# EasyEDA Pro project EasyEDA_Pro_SMD_3128_BM_3.epro, schematic CPLD Cartridge Schematic
Board Name: CPLD Cartridge; Create Date: 2026-02-11; Page Name: P1; Project Name: Flash Genesis/MD/32X Reproduction Cartridge; Schematic Name: CPLD Cartridge Schematic; Update Date: 2026-02-21; Company: EasyEDA.com; Drawed: Stargazer; Page Size: A3; Part Number: SMD_3128_BM_3; Reviewed: EasyEDA Pro; Version: R0
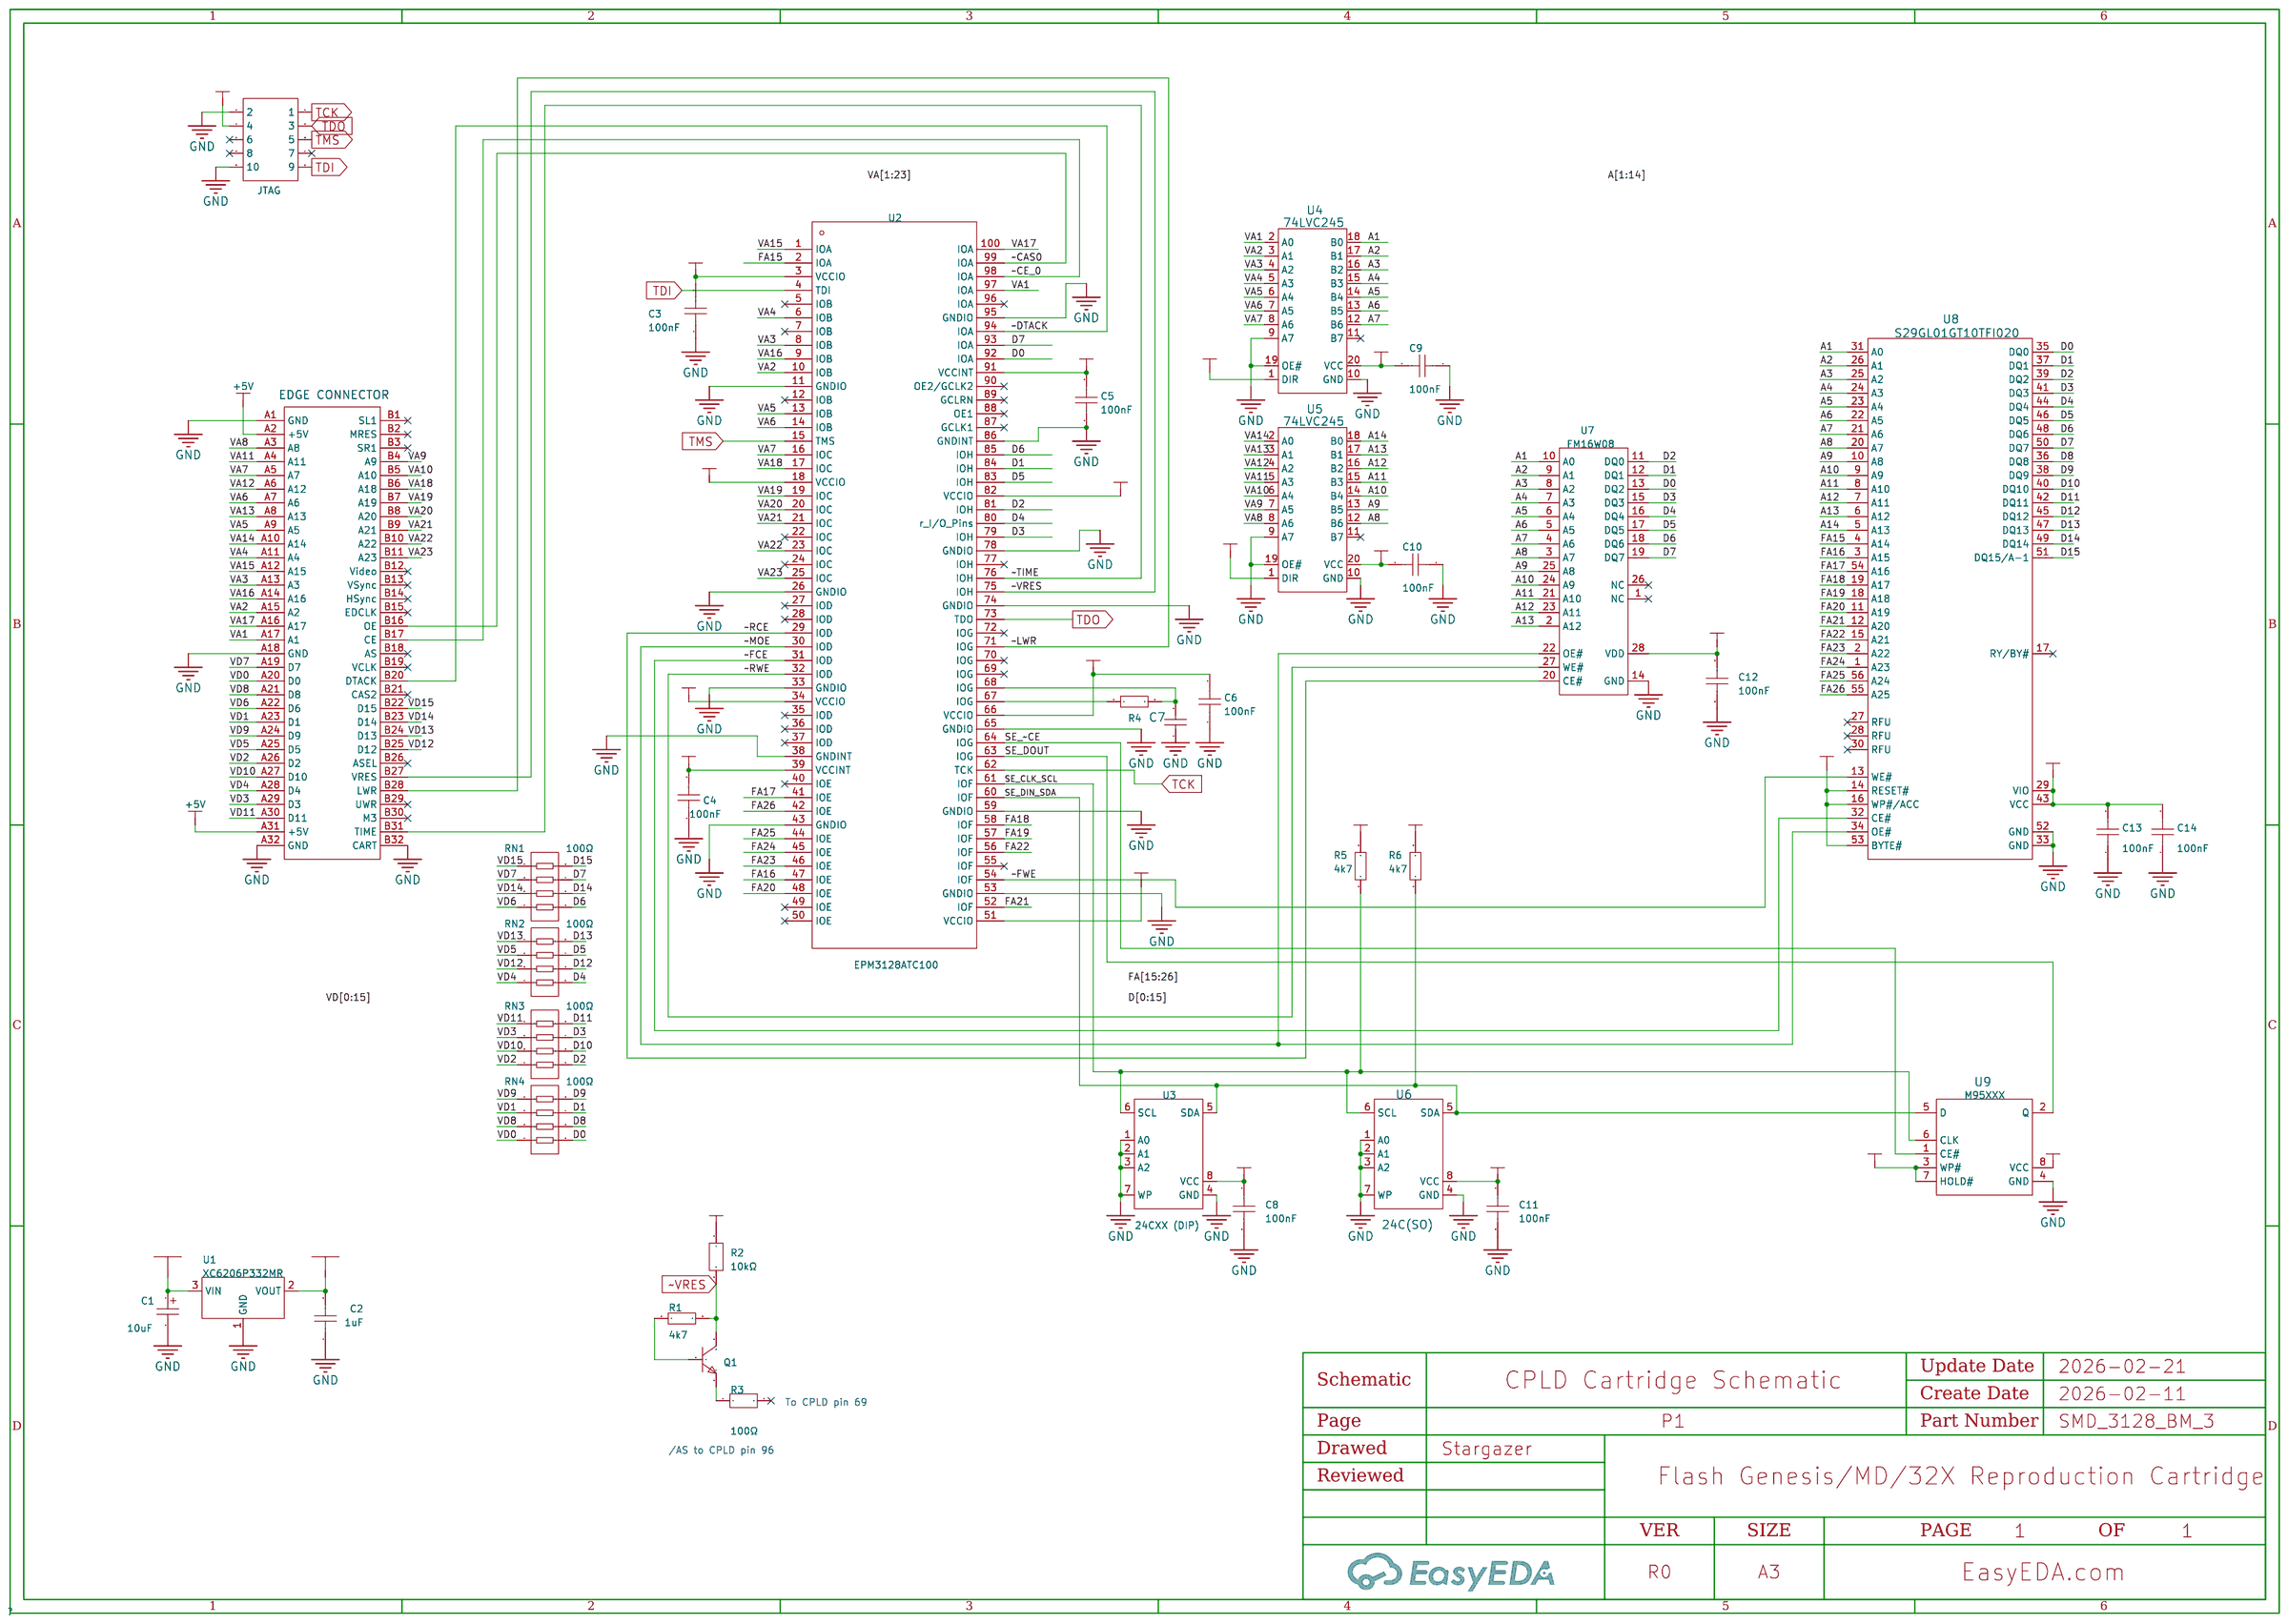
[diagram p0: schematic sheet]

## Parts
C1  10uF  [CASE-A_3216]
C2  1uF  [C0805]
C3  100nF  [C0603]
C4  100nF  [C0603]
C5  100nF  [C0603]
C6  100nF  [C0603]
C7  220pF  [C0402]
C8  100nF  [C0603]
C9  100nF  [C0603]
C10  100nF  [C0603]
C11  100nF  [C0603]
C12  100nF  [C0603]
C13  100nF  [C0603]
C14  100nF  [C0603]
CN1  JTAG  [IDC-TH_10P-P2.54_C5665]
CON1  EDGE CONNECTOR  [SEGA GENESIS CARTRIDGE EDGE CONNETOR]  (no BOM)
Q1  S8050 J3Y(RANGE:200-350)  [SOT-23-3_L3.0-W1.7-P0.95-LS2.9-BR]  (no BOM)
R1  4.7kΩ  [R0603]  (no BOM)
R2  10kΩ  [R0603]  (no BOM)
R3  100Ω  [R0603]  (no BOM)
R4  330Ω  [R0402]
R5  4.7kΩ  [R0603]
R6  4.7kΩ  [R0603]
RN1  100Ω  [RES-ARRAY-SMD_0603-8P-L3.2-W1.6-BL]
RN2  100Ω  [RES-ARRAY-SMD_0603-8P-L3.2-W1.6-BL]
RN3  100Ω  [RES-ARRAY-SMD_0603-8P-L3.2-W1.6-BL]
RN4  100Ω  [RES-ARRAY-SMD_0603-8P-L3.2-W1.6-BL]
U1  XC6206P332MR  [SOT-23-3_L2.9-W1.6-P1.90-LS2.8-BR]
U2  EPM3128ATC100  [TQFP-100_L14.0-W14.0-P0.50-LS16.0-BL]
U3  24CXX (DIP)  [PDIP-8_L9.6-W6.4-P2.54-LS7.6-BL]
U4  74LVC245  [TSSOP-20_L6.5-W4.4-P0.65-LS6.4-BL]
U5  74LVC245  [TSSOP-20_L6.5-W4.4-P0.65-LS6.4-BL]
U6  24C(SO)  [SOIC-8_L5.0-W4.0-P1.27-LS6.0-TL]
U7  FM16W08  [SOIC-28_L18.0-W7.5-P1.27-LS10.3-BL]
U8  S29GL01GT10TFI020  [TSOP-56_L14.1-W18.5-P0.50-LS20.2-BL]
U9  M95XXX  [SOIC-8_L5.0-W4.0-P1.27-LS6.0-TL]

## Library data of the parts
C1 = CA45A-A-16V-10uF-K: Capacitance: Tolerance:±10% Tolerance:±10% Rated Voltage: Equivalent Series Resistance(ESR):7Ω@100kHz Operating Temperature:-55℃~+125℃ Operating Temperature:-55℃~+125℃; LCSC Part Name: 10uF ±10% 16V; Supplier Part: C129279; Manufacturer: CEC(振华新云); JLCPCB Part Class: Extended Part; Datasheet: https://atta.szlcsc.com/upload/public/pdf/source/20170914/C129279_1505359932790968137.pdf; Supplier: LCSC; Tolerance: ±10%; Equivalent Series Resistance(ESR): 7Ω@100kHz; Operating Temperature: -55℃~+125℃
C2 = C0805X105K3RAC7800: Capacitance:1uF Tolerance:±10% Tolerance:±10% Voltage Rated:25V Temperature Coefficient:X7R; LCSC Part Name: 1uF ±10% 25V; Supplier Part: C599978; Manufacturer: KEMET(基美); Supplier Footprint: 0805; JLCPCB Part Class: Extended Part; Datasheet: https://atta.szlcsc.com/upload/public/pdf/source/20200618/C599807_353B987A11EFB304991393FBC85C4A7E.pdf; Supplier: LCSC; Tolerance: ±10%; Voltage Rated: 25V; Temperature Coefficient: X7R
C3-C6 C8-C14 = C0603C104K5RACAUTO7411: Capacitance:100nF Tolerance:±10% Tolerance:±10% Voltage Rated:50V Temperature Coefficient:X7R; LCSC Part Name: 100nF ±10% 50V; Supplier Part: C599651; Manufacturer: KEMET(基美); Supplier Footprint: 0603; JLCPCB Part Class: Extended Part; Datasheet: https://atta.szlcsc.com/upload/public/pdf/source/20200618/C599625_4BB905BF218B8C91468F2232BE4730AB.pdf; Supplier: LCSC; Tolerance: ±10%; Voltage Rated: 50V; Temperature Coefficient: X7R
C7 = CC0402JRNPO9BN221: Capacitance:220pF Tolerance:±5% Tolerance:±5% Voltage Rating:50V Temperature Coefficient:NP0; LCSC Part Name: 220pF ±5% 50V; Supplier Part: C107001; Manufacturer: YAGEO(国巨); Supplier Footprint: 0402; JLCPCB Part Class: Extended Part; Datasheet: https://item.szlcsc.com/datasheet/CC0402JRNPO9BN221/108217.html; Supplier: LCSC; Tolerance: ±5%; Voltage Rating: 50V; Temperature Coefficient: NP0
CN1 = 2.54-2*5P简牛: Connector Type:IDC Header Pitch:2.54mm Number of Positions or Pins:2x5P Current Rating:1A Holder Type:Through Hole Row Spacing:2.54mm Number of Rows:2 Number of PINs Per Row:5 Contact Material:Brass Contact Plating:Gold Operating Temperature:-55℃~+105℃ Op; LCSC Part Name: 2.54mm 2x5P 排数:2 每排P数:5; Supplier Part: C5665; Manufacturer: BOOMELE(博穆精密); Supplier Footprint: 插件,P=2.54mm; JLCPCB Part Class: Extended Part; Datasheet: https://item.szlcsc.com/datasheet/2.54-2*5P%25E7%25AE%2580%25E7%2589%259B/6118.html; Supplier: LCSC; Connector Type: IDC Header; Pitch: 2.54mm; Number of Positions or Pins: 2x5P; Current Rating: 1A; Holder Type: Through Hole; Row Spacing: 2.54mm; Number of Rows: 2; Number of PINs Per Row: 5; Contact Material: Brass; Contact Plating: Gold; Operating Temperature: -55℃~+105℃; Color: Black
CON1 = EDGE CONNECTOR
Q1 = S8050 J3Y(RANGE:200-350): type:NPN Current - Collector(Ic):500mA Collector - Emitter Voltage VCEO:25V Pd - Power Dissipation:300mW DC Current Gain:200@500mA,1V DC Current Gain:200@500mA,1V Transition frequency(fT):150MHz Current - Collector Cutoff:100nA Vce Saturation(VCE(sat)):60; LCSC Part Name: H档(200-350) NPN 电流:0.5A 电压:25V; Supplier Part: C2146; Manufacturer: CJ(江苏长电/长晶); Supplier Footprint: SOT-23; JLCPCB Part Class: Basic Part; Datasheet: https://item.szlcsc.com/datasheet/S8050%2520J3Y(RANGE%253A200-350)/2503.html; Supplier: LCSC; type: NPN; Current - Collector(Ic): 500mA; Collector - Emitter Voltage VCEO: 25V; Pd - Power Dissipation: 300mW; DC Current Gain: 200@500mA,1V; Transition frequency(fT): 150MHz; Current - Collector Cutoff: 100nA; Vce Saturation(VCE(sat)): 600mV@500mA,50mA; Operating Temperature: -55℃~+150℃; Emitter-Base Voltage(Vebo): 5V; Number: 1 NPN
R1 R5 R6 = 0603WAJ0472T5E_C25999: Type:Thick Film Resistors Resistance: Tolerance:±5% Tolerance:±5% Power(Watts): Temperature Coefficient:±100ppm/℃ Temperature Coefficient:±100ppm/℃ Overload Voltage (Max): Operating Temperature Range:-55℃~+155℃ Operating Temperature Range:-55℃~+155℃; LCSC Part Name: 4.7kΩ ±5% 100mW; Supplier Part: C25999; Manufacturer: UNI-ROYAL(厚声); Manufacturer Part: 0603WAJ0472T5E; Supplier Footprint: 0603; JLCPCB Part Class: Extended Part; Datasheet: https://atta.szlcsc.com/upload/public/pdf/source/20200306/C422600_1E6D84923E4A46A82E41ADD87F860B5C.pdf; Supplier: LCSC; Type: Thick Film Resistors; Tolerance: ±5%; Temperature Coefficient: ±100ppm/℃; Operating Temperature Range: -55℃~+155℃
R2 = AC0603JR-1310KL: Type:Thick Film Resistor Resistance:10kΩ Tolerance:±5% Tolerance:±5% Power(Watts):100mW Voltage-Supply(Max):75V Temperature Coefficient:±100ppm/℃ Temperature Coefficient:±100ppm/℃ Operating Temperature:-55℃~+155℃ Operating Temperature:-55℃~+155℃; LCSC Part Name: 厚膜电阻 10kΩ ±5% 100mW; Supplier Part: C3969570; Manufacturer: YAGEO(国巨); Supplier Footprint: 0603; JLCPCB Part Class: Extended Part; Datasheet: https://item.szlcsc.com/datasheet/AC0603JR-1310KL/4538135.html; Supplier: LCSC; Type: Thick Film Resistor; Tolerance: ±5%; Power(Watts): 100mW; Voltage-Supply(Max): 75V; Temperature Coefficient: ±100ppm/℃; Operating Temperature: -55℃~+155℃
R3 = SR0603JR-7T100RL: Type:Thick Film Resistor Resistance:100Ω Tolerance:±5% Tolerance:±5% Power(Watts):250mW Temperature Coefficient:±100ppm/℃ Temperature Coefficient:±100ppm/℃ Operating Temperature:-55℃~+155℃ Operating Temperature:-55℃~+155℃; LCSC Part Name: 厚膜电阻 100Ω ±5% 250mW; Supplier Part: C7318988; Manufacturer: YAGEO(国巨); Supplier Footprint: 0603; JLCPCB Part Class: Extended Part; Datasheet: https://item.szlcsc.com/datasheet/SR0603JR-7T100RL/8289618.html; Supplier: LCSC; Type: Thick Film Resistor; Tolerance: ±5%; Power(Watts): 250mW; Temperature Coefficient: ±100ppm/℃; Operating Temperature: -55℃~+155℃
R4 = RC0402JR-07330RL: Type:Thick Film Resistors Resistance: Tolerance:±5% Tolerance:±5% Power(Watts): Overload Voltage (Max): Temperature Coefficient:±100ppm/℃ Temperature Coefficient:±100ppm/℃ Operating Temperature Range:-55℃~+155℃ Operating Temperature Range:-55℃~+155℃; LCSC Part Name: 厚膜电阻 330Ω ±5% 62.5mW; Supplier Part: C105876; Manufacturer: YAGEO(国巨); Supplier Footprint: 0402; JLCPCB Part Class: Extended Part; Datasheet: https://atta.szlcsc.com/upload/public/pdf/source/20180821/C275644_0D56F95EFF785E7D9A1FEF436B37DA78.pdf; Supplier: LCSC; Type: Thick Film Resistors; Tolerance: ±5%; Temperature Coefficient: ±100ppm/℃; Operating Temperature Range: -55℃~+155℃
RN1-RN4 = YC164-JR-07100RL: Number of Resistors: Resistance: Tolerance:±5% Tolerance:±5% Power(Watts): Temperature Coefficient:±200ppm/℃ Temperature Coefficient:±200ppm/℃ Number of Pins:; LCSC Part Name: 100Ω ±5%; Supplier Part: C424283; Manufacturer: YAGEO(国巨); Supplier Footprint: 0603x4; JLCPCB Part Class: Extended Part; Datasheet: https://atta.szlcsc.com/upload/public/pdf/source/20190902/C424283_E74F2DBB2DCB7FAC0AAD9E6880309834.pdf; Supplier: LCSC; Tolerance: ±5%; Temperature Coefficient: ±200ppm/℃
U1 = XC6206P332MR: LCSC Part Name: XC6206P332MR SOT-23-3L; Supplier Part: C2897477; Manufacturer: YONGYUTAI(永裕泰); Supplier Footprint: SOT-23-3L; JLCPCB Part Class: Extended Part; Datasheet: https://atta.szlcsc.com/upload/public/pdf/source/20210918/C2897477_145C585ACB0B0BA7FFD7BB032BFF24B8.pdf; Supplier: LCSC
U2 = EPM3128ATC100-10N: LCSC Part Name: 停产 EPM3128ATC100-10N; Supplier Part: C10043; Manufacturer: Intel/Altera; Supplier Footprint: TQFP-100(14x14); JLCPCB Part Class: Extended Part; Datasheet: https://item.szlcsc.com/datasheet/EPM3128ATC100-10N/10579.html; Supplier: LCSC
U3 = AT24C01A-10PC-2.5: LCSC Part Name: 低电压串行EEPROM; Supplier Part: C19551159; Manufacturer: MICROCHIP(美国微芯); Supplier Footprint: PDIP-8; JLCPCB Part Class: Extended Part; Datasheet: https://atta.szlcsc.com/upload/public/pdf/source/20230907/D6188EBC824859916303880B745F8BF0.pdf; Supplier: LCSC
U4 U5 = 74LVC245A
U6 = 24C02CT-I/SN: Supplier: LCSC; Supplier Part: C2061172; Manufacturer: null
U7 = FM16W08-SG_C466867: LCSC Part Name: FM16W08-SG; Supplier Part: C466867; Manufacturer: CYPRESS(赛普拉斯); Manufacturer Part: FM16W08-SG; Supplier Footprint: SOIC-28-300mil; JLCPCB Part Class: Extended Part; Datasheet: https://atta.szlcsc.com/upload/public/pdf/source/20191206/C466867_DAC19835796936B895C16B18378E9F34.pdf; Supplier: LCSC
U8 = S29GL01GT10TFI020: Supplier: LCSC; Supplier Part: C511150; Manufacturer: CypressSemicon; JLCPCB Part Class: ExtendedPart
U9 = M95320-WMN6P: Supplier: LCSC; Supplier Part: C1353523; Manufacturer: ST(意法半导体); JLCPCB Part Class: Extended Part; LCSC Part Name: M95320 WMN6P; Supplier Footprint: SO-8

## Nets
+3V3: C2.2 C3.2 C4.2 C5.2 C6.2 C8.1 C9.2 C10.2 C11.1 C12.1 C13.2 C14.2 CN1.4 R2.1 R5.2 R6.2 U1.2(VOUT) U2.3(VCCIO) U2.18(VCCIO) U2.34(VCCIO) U2.39(VCCINT) U2.51(VCCIO) U2.66(VCCIO) U2.82(VCCIO) U2.91(VCCINT) U3.8(VCC) U4.1(DIR) U4.20(VCC) U5.1(DIR) U5.20(VCC) U6.8(VCC) U7.28(VDD) U8.14(RESET#) U8.16(WP#/ACC) U8.29(VIO) U8.43(VCC) U8.53(BYTE#) U9.3(WP#) U9.7(HOLD#) U9.8(VCC)
+5V: C1.1 CON1.A2(+5V) CON1.A31(+5V) U1.3(VIN)
GND: C1.2 C2.1 C3.1 C4.1 C5.1 C6.1 C7.1 C8.2 C9.1 C10.1 C11.2 C12.2 C13.1 C14.1 CN1.2 CN1.10 CON1.A1(GND) CON1.A18(GND) CON1.A32(GND) CON1.B32(CART) U1.1(GND) U2.11(GNDIO) U2.26(GNDIO) U2.33(GNDIO) U2.38(GNDINT) U2.43(GNDIO) U2.53(GNDIO) U2.59(GNDIO) U2.65(GNDIO) U2.74(GNDIO) U2.78(GNDIO) U2.86(GNDINT) U2.95(GNDIO) U3.1(A0) U3.2(A1) U3.3(A2) U3.4(GND) U3.7(WP) U4.9(A7) U4.10(GND) U4.19(OE#) U5.9(A7) U5.10(GND) U5.19(OE#) U6.1(A0) U6.2(A1) U6.3(A2) U6.4(GND) U6.7(WP) U7.14(GND) U8.33(GND) U8.52(GND) U9.4(GND)
A1: U4.18(B0) U7.10(A0) U8.31(A0)
A2: U4.17(B1) U7.9(A1) U8.26(A1)
A3: U4.16(B2) U7.8(A2) U8.25(A2)
A4: U4.15(B3) U7.7(A3) U8.24(A3)
A5: U4.14(B4) U7.6(A4) U8.23(A4)
A6: U4.13(B5) U7.5(A5) U8.22(A5)
A7: U4.12(B6) U7.4(A6) U8.21(A6)
A8: U5.12(B6) U7.3(A7) U8.20(A7)
A9: U5.13(B5) U7.25(A8) U8.10(A8)
A10: U5.14(B4) U7.24(A9) U8.9(A9)
A11: U5.15(B3) U7.21(A10) U8.8(A10)
A12: U5.16(B2) U7.23(A11) U8.7(A11)
A13: U5.17(B1) U7.2(A12) U8.6(A12)
A14: U5.18(B0) U8.5(A13)
D0: RN4.5 U2.92(IOA) U7.13(DQ2) U8.35(DQ0)
D1: RN4.7 U2.84(IOH) U7.12(DQ1) U8.37(DQ1)
D2: RN3.5 U2.81(IOH) U7.11(DQ0) U8.39(DQ2)
D3: RN3.7 U2.79(IOH) U7.15(DQ3) U8.41(DQ3)
D4: RN2.5 U2.80(r I/O Pins) U7.16(DQ4) U8.44(DQ4)
D5: RN2.7 U2.83(IOH) U7.17(DQ5) U8.46(DQ5)
D6: RN1.5 U2.85(IOH) U7.18(DQ6) U8.48(DQ6)
D7: RN1.7 U2.93(IOA) U7.19(DQ7) U8.50(DQ7)
D8: RN4.6 U8.36(DQ8)
D9: RN4.8 U8.38(DQ9)
D10: RN3.6 U8.40(DQ10)
D11: RN3.8 U8.42(DQ11)
D12: RN2.6 U8.45(DQ12)
D13: RN2.8 U8.47(DQ13)
D14: RN1.6 U8.49(DQ14)
D15: RN1.8 U8.51(DQ15/A-1)
FA15: U2.2(IOA) U8.4(A14)
FA16: U2.47(IOE) U8.3(A15)
FA17: U2.41(IOE) U8.54(A16)
FA18: U2.58(IOF) U8.19(A17)
FA19: U2.57(IOF) U8.18(A18)
FA20: U2.48(IOE) U8.11(A19)
FA21: U2.52(IOF) U8.12(A20)
FA22: U2.56(IOF) U8.15(A21)
FA23: U2.46(IOE) U8.2(A22)
FA24: U2.45(IOE) U8.1(A23)
FA25: U2.44(IOE) U8.56(A24)
FA26: U2.42(IOE) U8.55(A25)
SE_CLK_SCL: R5.1 U2.61(IOF) U3.6(SCL) U6.6(SCL) U9.6(CLK)
SE_DIN_SDA: R6.1 U2.60(IOF) U3.5(SDA) U6.5(SDA) U9.5(D)
SE_DOUT: U2.63(IOG) U9.2(Q)
SE_~CE: U2.64(IOG) U9.1(CE#)
TCK: CN1.1 U2.62(TCK)
TDI: CN1.9 U2.4(TDI)
TDO: CN1.3 U2.73(TDO)
TMS: CN1.5 U2.15(TMS)
VA1: CON1.A17(A1) U2.97(IOA) U4.2(A0)
VA2: CON1.A15(A2) U2.10(IOB) U4.3(A1)
VA3: CON1.A13(A3) U2.8(IOB) U4.4(A2)
VA4: CON1.A11(A4) U2.6(IOB) U4.5(A3)
VA5: CON1.A9(A5) U2.13(IOB) U4.6(A4)
VA6: CON1.A7(A6) U2.14(IOB) U4.7(A5)
VA7: CON1.A5(A7) U2.16(IOC) U4.8(A6)
VA8: CON1.A3(A8) U5.8(A6)
VA9: CON1.B4(A9) U5.7(A5)
VA10: CON1.B5(A10) U5.6(A4)
VA11: CON1.A4(A11) U5.5(A3)
VA12: CON1.A6(A12) U5.4(A2)
VA13: CON1.A8(A13) U5.3(A1)
VA14: CON1.A10(A14) U5.2(A0)
VA15: CON1.A12(A15) U2.1(IOA)
VA16: CON1.A14(A16) U2.9(IOB)
VA17: CON1.A16(A17) U2.100(IOA)
VA18: CON1.B6(A18) U2.17(IOC)
VA19: CON1.B7(A19) U2.19(IOC)
VA20: CON1.B8(A20) U2.20(IOC)
VA21: CON1.B9(A21) U2.21(IOC)
VA22: CON1.B10(A22) U2.23(IOC)
VA23: CON1.B11(A23) U2.25(IOC)
VD0: CON1.A20(D0) RN4.4
VD1: CON1.A23(D1) RN4.2
VD2: CON1.A26(D2) RN3.4
VD3: CON1.A29(D3) RN3.2
VD4: CON1.A28(D4) RN2.4
VD5: CON1.A25(D5) RN2.2
VD6: CON1.A22(D6) RN1.4
VD7: CON1.A19(D7) RN1.2
VD8: CON1.A21(D8) RN4.3
VD9: CON1.A24(D9) RN4.1
VD10: CON1.A27(D10) RN3.3
VD11: CON1.A30(D11) RN3.1
VD12: CON1.B25(D12) RN2.3
VD13: CON1.B24(D13) RN2.1
VD14: CON1.B23(D14) RN1.3
VD15: CON1.B22(D15) RN1.1
~CAS0: CON1.B16(OE) U2.99(IOA)
~CE_0: CON1.B17(CE) U2.98(IOA)
~DTACK: CON1.B20(DTACK) U2.94(IOA)
~FCE: U2.31(IOD) U8.32(CE#)
~FWE: U2.54(IOF) U8.13(WE#)
~LWR: CON1.B28(LWR) U2.71(IOG)
~MOE: U2.30(IOD) U7.22(OE#) U8.34(OE#)
~RCE: U2.29(IOD) U7.20(CE#)
~RWE: U2.32(IOD) U7.27(WE#)
~TIME: CON1.B31(TIME) U2.76(IOH)
~VRES: CON1.B27(VRES) Q1.3(C) R1.2 R2.2 U2.75(IOH)
$1N2516: R4.1 U2.67(IOG)
$1N2517: C7.2 R4.2 U2.68(IOG)
Net-(Q1-1): Q1.1(B) R1.1
Net-(Q1-2): Q1.2(E) R3.1

Not connected (* = marked no-connect by the designer): CN1 6* 7* 8*; CON1 B1(SL1)* B2(MRES)* B3(SR1)* B12(Video)* B13(VSync)* B14(HSync)* B15(EDCLK)* B18(AS)* B19(VCLK)* B21(CAS2)* B26(ASEL)* B29(UWR)* B30(M3)*; R3 2*; U2 5(IOB)* 7(IOB)* 12(IOB)* 22(IOC)* 24(IOC)* 27(IOD)* 28(IOD)* 35(IOD)* 36(IOD)* 37(IOD)* 40(IOE)* 49(IOE)* 50(IOE)* 55(IOF)* 69(IOG)* 70(IOG)* 72(IOG)* 77(IOH)* 87(GCLK1)* 88(OE1)* 89(GCLRN)* 90(OE2/GCLK2)* 96(IOA)*; U4 11(B7)*; U5 11(B7)*; U7 1(NC)* 26(NC)*; U8 17(RY/BY#)* 27(RFU)* 28(RFU)* 30(RFU)*

## Notes on the sheet
- To CPLD pin 69
- /AS to CPLD pin 96
